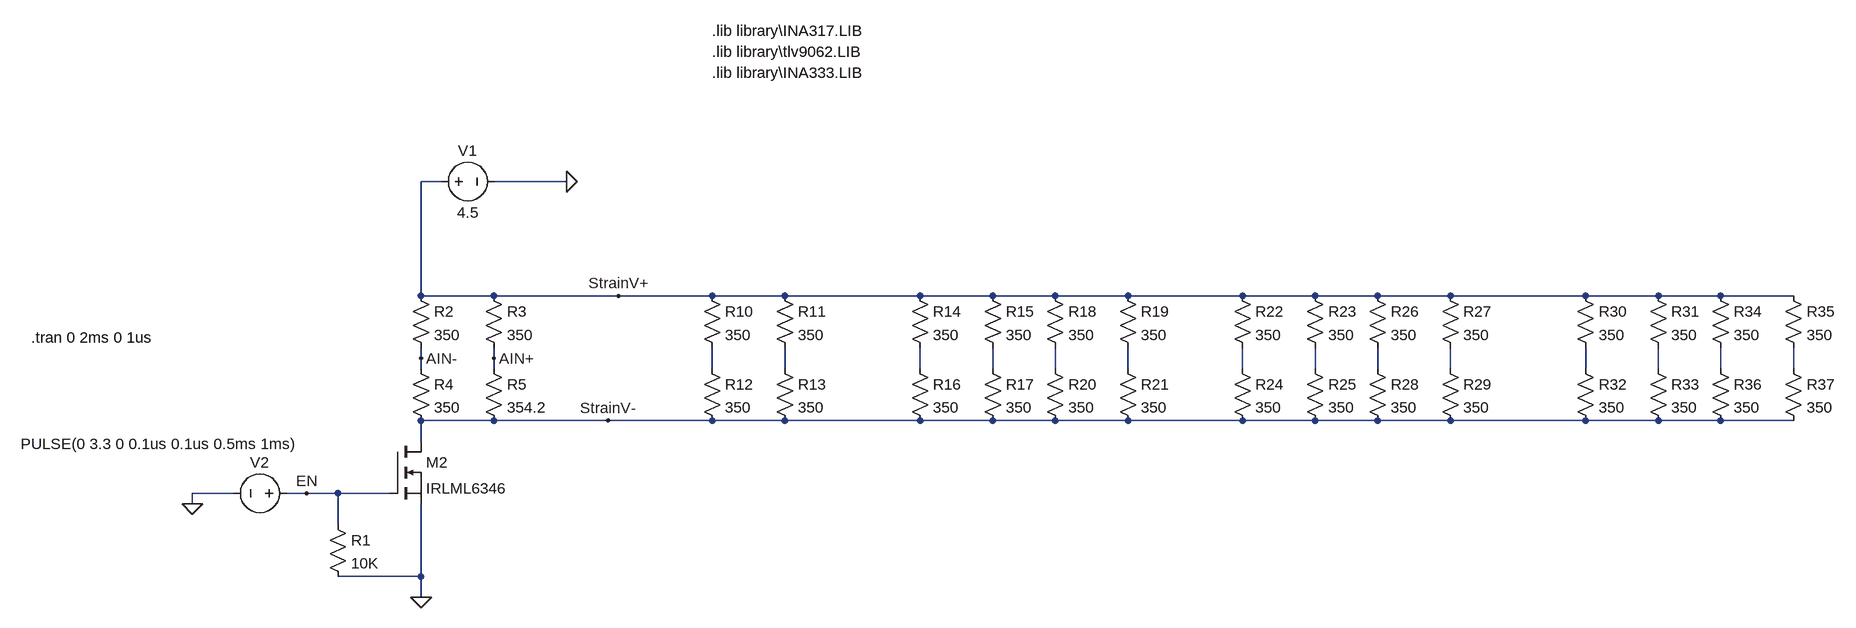
[diagram p0: schematic strainGaugeTransientAnalysis.asc]
strainGaugeTransientAnalysis.asc, the LTspice schematic file:
Version 4.1
SHEET 1 2284 1760
WIRE 32 96 0 96
WIRE 224 96 112 96
WIRE 0 272 0 96
WIRE 112 272 0 272
WIRE 304 272 112 272
WIRE 448 272 304 272
WIRE 560 272 448 272
WIRE 768 272 560 272
WIRE 880 272 768 272
WIRE 976 272 880 272
WIRE 1088 272 976 272
WIRE 1264 272 1088 272
WIRE 1376 272 1264 272
WIRE 1472 272 1376 272
WIRE 1584 272 1472 272
WIRE 1792 272 1584 272
WIRE 1904 272 1792 272
WIRE 2000 272 1904 272
WIRE 2112 272 2000 272
WIRE 0 368 0 352
WIRE 112 368 112 352
WIRE 0 384 0 368
WIRE 112 384 112 368
WIRE 448 384 448 352
WIRE 560 384 560 352
WIRE 768 384 768 352
WIRE 880 384 880 352
WIRE 976 384 976 352
WIRE 1088 384 1088 352
WIRE 1264 384 1264 352
WIRE 1376 384 1376 352
WIRE 1472 384 1472 352
WIRE 1584 384 1584 352
WIRE 1792 384 1792 352
WIRE 1904 384 1904 352
WIRE 2000 384 2000 352
WIRE 2112 384 2112 352
WIRE 112 464 0 464
WIRE 288 464 112 464
WIRE 448 464 288 464
WIRE 560 464 448 464
WIRE 768 464 560 464
WIRE 880 464 768 464
WIRE 976 464 880 464
WIRE 1088 464 976 464
WIRE 1264 464 1088 464
WIRE 1376 464 1264 464
WIRE 1472 464 1376 464
WIRE 1584 464 1472 464
WIRE 1792 464 1584 464
WIRE 1904 464 1792 464
WIRE 2000 464 1904 464
WIRE 2112 464 2000 464
WIRE 0 496 0 464
WIRE -288 576 -352 576
WIRE -176 576 -208 576
WIRE -128 576 -176 576
WIRE -48 576 -128 576
WIRE -352 592 -352 576
WIRE -128 624 -128 576
WIRE 0 704 0 592
WIRE 0 704 -128 704
WIRE 0 736 0 704
FLAG 224 96 0
FLAG -352 592 0
FLAG 0 736 0
FLAG 304 272 StrainV+
FLAG 288 464 StrainV-
FLAG -176 576 EN
FLAG 112 368 AIN+
FLAG 0 368 AIN-
SYMBOL voltage 16 96 R270
WINDOW 0 32 56 VTop 2
WINDOW 3 -32 56 VBottom 2
WINDOW 123 0 0 Left 0
WINDOW 39 0 0 Left 0
SYMATTR InstName V1
SYMATTR Value 4.5
SYMBOL voltage -192 576 R90
WINDOW 0 -32 56 VBottom 2
WINDOW 3 -92 211 VTop 2
WINDOW 123 0 0 Left 0
WINDOW 39 0 0 Left 0
SYMATTR InstName V2
SYMATTR Value PULSE(0 3.3 0 0.1us 0.1us 0.5ms 1ms)
SYMBOL res -16 256 R0
SYMATTR InstName R2
SYMATTR Value 350
SYMBOL res 96 256 R0
SYMATTR InstName R3
SYMATTR Value 350
SYMBOL res -16 368 R0
SYMATTR InstName R4
SYMATTR Value 350
SYMBOL res 432 256 R0
SYMATTR InstName R10
SYMATTR Value 350
SYMBOL res 544 256 R0
SYMATTR InstName R11
SYMATTR Value 350
SYMBOL res 432 368 R0
SYMATTR InstName R12
SYMATTR Value 350
SYMBOL res 544 368 R0
SYMATTR InstName R13
SYMATTR Value 350
SYMBOL res 752 256 R0
SYMATTR InstName R14
SYMATTR Value 350
SYMBOL res 864 256 R0
SYMATTR InstName R15
SYMATTR Value 350
SYMBOL res 752 368 R0
SYMATTR InstName R16
SYMATTR Value 350
SYMBOL res 864 368 R0
SYMATTR InstName R17
SYMATTR Value 350
SYMBOL res 960 256 R0
SYMATTR InstName R18
SYMATTR Value 350
SYMBOL res 1072 256 R0
SYMATTR InstName R19
SYMATTR Value 350
SYMBOL res 960 368 R0
SYMATTR InstName R20
SYMATTR Value 350
SYMBOL res 1072 368 R0
SYMATTR InstName R21
SYMATTR Value 350
SYMBOL res 1248 256 R0
SYMATTR InstName R22
SYMATTR Value 350
SYMBOL res 1360 256 R0
SYMATTR InstName R23
SYMATTR Value 350
SYMBOL res 1248 368 R0
SYMATTR InstName R24
SYMATTR Value 350
SYMBOL res 1360 368 R0
SYMATTR InstName R25
SYMATTR Value 350
SYMBOL res 1456 256 R0
SYMATTR InstName R26
SYMATTR Value 350
SYMBOL res 1568 256 R0
SYMATTR InstName R27
SYMATTR Value 350
SYMBOL res 1456 368 R0
SYMATTR InstName R28
SYMATTR Value 350
SYMBOL res 1568 368 R0
SYMATTR InstName R29
SYMATTR Value 350
SYMBOL res 1776 256 R0
SYMATTR InstName R30
SYMATTR Value 350
SYMBOL res 1888 256 R0
SYMATTR InstName R31
SYMATTR Value 350
SYMBOL res 1776 368 R0
SYMATTR InstName R32
SYMATTR Value 350
SYMBOL res 1888 368 R0
SYMATTR InstName R33
SYMATTR Value 350
SYMBOL res 1984 256 R0
SYMATTR InstName R34
SYMATTR Value 350
SYMBOL res 2096 256 R0
SYMATTR InstName R35
SYMATTR Value 350
SYMBOL res 1984 368 R0
SYMATTR InstName R36
SYMATTR Value 350
SYMBOL res 2096 368 R0
SYMATTR InstName R37
SYMATTR Value 350
SYMBOL res 96 368 R0
SYMATTR InstName R5
SYMATTR Value 354.2
SYMBOL nmos -48 496 R0
SYMATTR InstName M2
SYMATTR Value IRLML6346
SYMBOL res -144 608 R0
SYMATTR InstName R1
SYMATTR Value 10K
TEXT 448 -136 Left 2 !.lib library\\INA317.LIB
TEXT 448 -104 Left 2 !.lib library\\tlv9062.LIB
TEXT 448 -72 Left 2 !.lib library\\INA333.LIB
TEXT -600 336 Left 2 !.tran 0 2ms 0 1us

The netlist it stands for:
* strainGaugeTransientAnalysis.asc
V1 StrainV+ 0 4.5
V2 EN 0 PULSE(0 3.3 0 0.1us 0.1us 0.5ms 1ms)
R2 StrainV+ AIN- 350
R3 StrainV+ AIN+ 350
R4 AIN- StrainV- 350
R10 StrainV+ N001 350
R11 StrainV+ N002 350
R12 N001 StrainV- 350
R13 N002 StrainV- 350
R14 StrainV+ N003 350
R15 StrainV+ N004 350
R16 N003 StrainV- 350
R17 N004 StrainV- 350
R18 StrainV+ N005 350
R19 StrainV+ N006 350
R20 N005 StrainV- 350
R21 N006 StrainV- 350
R22 StrainV+ N007 350
R23 StrainV+ N008 350
R24 N007 StrainV- 350
R25 N008 StrainV- 350
R26 StrainV+ N009 350
R27 StrainV+ N010 350
R28 N009 StrainV- 350
R29 N010 StrainV- 350
R30 StrainV+ N011 350
R31 StrainV+ N012 350
R32 N011 StrainV- 350
R33 N012 StrainV- 350
R34 StrainV+ N013 350
R35 StrainV+ N014 350
R36 N013 StrainV- 350
R37 N014 StrainV- 350
R5 AIN+ StrainV- 354.2
M2 StrainV- EN 0 0 IRLML6346
R1 EN 0 10K
.model NMOS NMOS
.model PMOS PMOS
.lib standard.mos
.lib library\INA317.LIB
.lib library\tlv9062.LIB
.lib library\INA333.LIB
.tran 0 2ms 0 1us
.backanno
.end